# EAGLE design Asteroid-v4 (EAGLE 6.4)
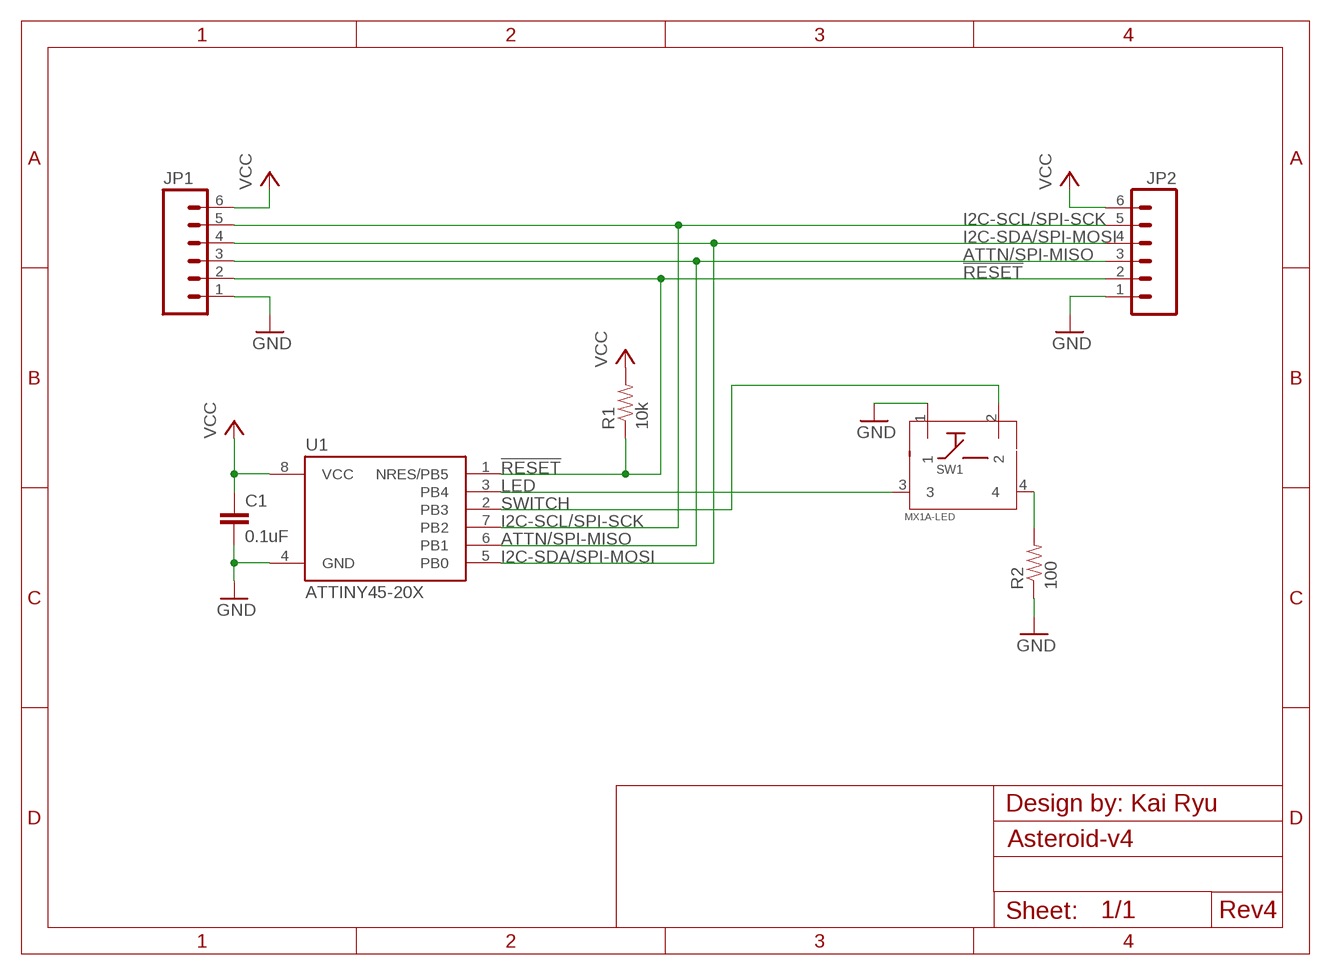
[diagram p0: schematic, sheet 1]

## Parts
C1  0.1uF  CAP0603-CAP  [0603-CAP]
JP1  M06SIP  [1X06]
JP2  M06SIP  [1X06]
R1  10k  RESISTOR0603-RES  [0603-RES]
R2  100  RESISTOR0603-RES  [0603-RES]
SW1  MX1A-LED  [MX1A-LED]
U1  ATTINY45-20X  [TSSOP8_4MM4]

## Nets
!RESET!: JP1.2 JP2.2 R1.1 U1.1(NRES/PB5)
ATTN/SPI-MISO: JP1.3 JP2.3 U1.6(PB1)
GND [GND]: C1.2 JP1.1 JP2.1 R2.1 SW1.1 U1.4(GND)
I2C-SCL/SPI-SCK: JP1.5 JP2.5 U1.7(PB2)
I2C-SDA/SPI-MOSI: JP1.4 JP2.4 U1.5(PB0)
LED: SW1.3 U1.3(PB4)
N$1: R2.2 SW1.4
SWITCH: SW1.2 U1.2(PB3)
VCC [VCC]: C1.1 JP1.6 JP2.6 R1.2 U1.8(VCC)

## Notes on the sheet
- Design by: Kai Ryu
- Rev4

## Library data of the parts
C1 = SparkFun-Passives:CAP: Capacitor Standard 0603 ceramic capacitor, and 0.1" leaded capacitor.
JP1 JP2 = SparkFun-Connectors:M06: Header 6 Standard 6-pin 0.1" header. Use with straight break away headers (SKU : PRT-00116), right angle break away headers (PRT-00553), swiss pins (PRT-00743), machine pins (PRT-00117), and female headers (PRT-00115). Molex polarized connector foot print use with SKU : PRT-08094 with associated crimp pins and housings. NOTES ON THE VARIANTS LOCK and LOCK_LONGPADS... This footprint was designed to help hold the alignment of a through-hole component (i.e. 6-pin header) while soldering it into place. You may notice that each hole has been shifted either up or down by 0.005 of an inch from it's more standard position (which is a perfectly straight line). This slight alteration caused the pins (the squares in the middle) to touch the edges of the holes. Because they are alternating, it causes a "brace" to hold the component in place. 0.005 has proven to be the perfect amount of "off-center" position when using our standard breakaway headers. Although looks a little odd when you look at the bare footprint, once you have a header in there, the alteration is very hard to notice. Also, if you push a header all the way into place, it is covered up entirely on the bottom side. This idea of altering the position of holes to aid alignment will be further integrated into the Sparkfun Library for other footprints. It can help hold any component with 3 or more connection pins.
R1 R2 = SparkFun-Resistors:RESISTOR: Resistor Basic schematic elements and footprints for 0603, 1206, and PTH resistors.
SW1 = cherry-mx-1:MX1A-LED
U1 = attiny25_45_85:ATTINY45*: ATMEL ATtiny 45 Packages: P = PDIP 08 30mil S = SOIC 08 EIAJ 208mil X = TSSOP 08 4.4mm Technologies Note: for complete ordering code (temp. range, finish, tape&reel etc.) see www.atmel.com • Supply Voltage: V = (1.8…5.5)V | [blank] = (2.7…5.5)V • Speed: 10 = 10 MHz | 20 = 20 MHz Author: Dipl.-Ing. FH Rainer Bayer HHN Hochschule Heilbronn (Heilbronn University), rainer.bayer@hs-heilbronn.de Ingenieurbüro ing-rb, mail@ing-rb.de

## Net classes
2 VCC: width 0.305 mm

## Board
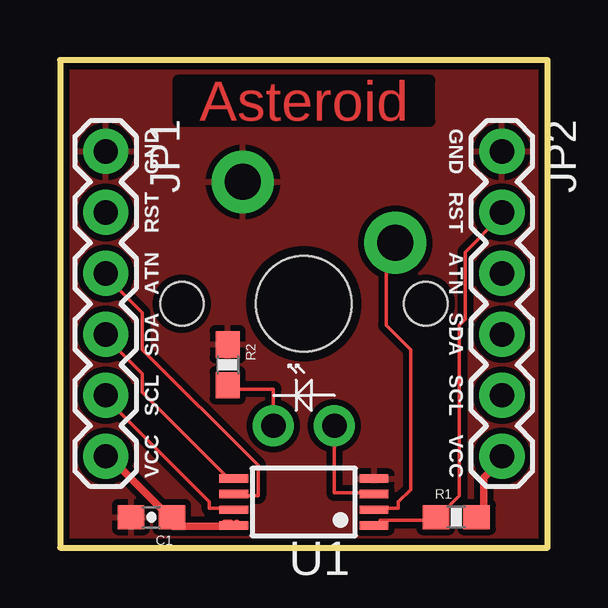
[diagram p1: board, top side]
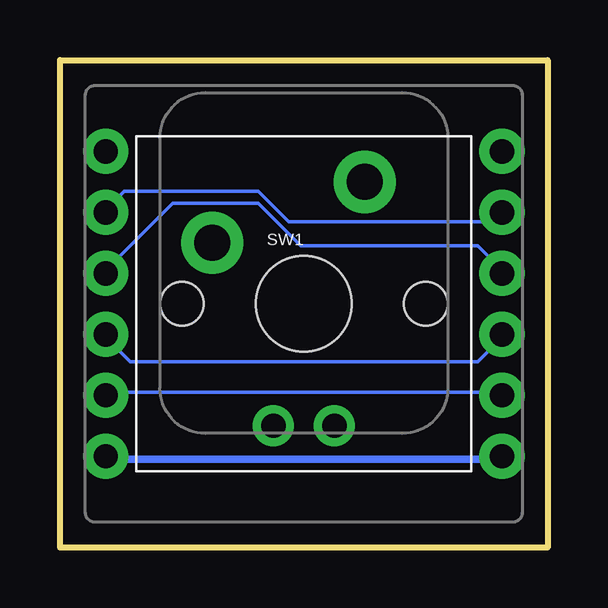
[diagram p2: board, bottom side, seen from below]

Size 20.32 x 20.32 mm. Coordinates in mm from the lower left corner, seen from the top.
Outline: 0,0 20.32,0 20.32,20.32 0,20.32 0,0
Copper layers (1*16): Top 0.035mm / dielectric 1.5mm / Bottom 0.035mm
Design rules "Fusion_eagle_rule_v1.1": minimum track width 6mil, minimum drill 12mil, track to track 6mil, track to pad 6mil, pad to pad 6mil, via to via 6mil, smd to smd 0mil, copper to edge 10mil, drill to drill 10mil, minimum pad ring 10mil, minimum via ring 6mil, stop-mask expansion 2mil, vias tented up to drill 100mil, thermal gap 10mil

### Footprints (pad centres in the part's own frame; a part is rotated, then mirrored left to right if it is on the bottom)
0603-CAP = smd 1.1 x 1: 1 -0.85,0; 2 0.85,0
1X06 = drill 1.016 pad 1.88: 1 0,0; 2 2.54,0; 3 5.08,0; 4 7.62,0; 5 10.16,0; 6 12.7,0
0603-RES = smd 1.1 x 1: 1 -0.85,0; 2 0.85,0
MX1A-LED = drill 1.499 pad 2.591: 1 2.54,5.08; 2 -3.81,2.54 | drill 1.016 pad 1.702: 3 -1.27,-5.08; 4 1.27,-5.08 | hole 3.988: 0,0 | hole 1.803: 5.08,0; -5.08,0
TSSOP8_4MM4 = smd 1.2 x 0.35: 1 -2.925,0.975; 2 -2.925,0.325; 3 -2.925,-0.325; 4 -2.925,-0.975; 5 2.925,-0.975; 6 2.925,-0.325; 7 2.925,0.325; 8 2.925,0.975

### Placement (x,y rotation side)
C1  3.81,1.27 180 top
JP1  1.91,16.51 270 top
JP2  18.41,16.51 270 top
R1  16.51,1.27 0 top
R2  6.99,7.62 270 top
SW1  10.16,10.16 0 bottom
U1  10.16,1.91 180 top

### Tracks (layer width: path | path; a pad name or v marks a point on that pad's centre or on a via)
!RESET!
  Top 0.152: U1.1 13.34,0.89 13.34,1.14 15.62,1.14 R1.1 15.88,1.4 16.64,2.16 16.64,9.27 16.89,9.53 16.89,12.32 18.41,13.84 JP2.2
  Bottom 0.152: JP1.2 1.91,13.84 2.16,13.59 10.79,13.59 12.06,14.86 17.65,14.86 18.41,14.1 JP2.2
ATTN/SPI-MISO
  Top 0.152: U1.6 7.24,2.16 8.26,2.16 8.26,3.43 3.43,8.26 3.43,9.78 1.91,11.3 JP1.3
  Bottom 0.152: JP2.3 18.41,11.56 15.62,14.35 12.06,14.35 10.29,12.57 2.92,12.57 1.91,11.56 JP1.3
GND
  pour Top (isolate 0.254): 0,20.32 20.32,20.32 20.32,0 0,0
I2C-SCL/SPI-SCK
  Top 0.152: U1.7 6.99,1.65 6.22,1.65 6.22,1.91 1.91,6.22 JP1.5
  Bottom 0.152: JP2.5 18.41,6.48 1.91,6.48 JP1.5
I2C-SDA/SPI-MOSI
  Top 0.152: U1.5 6.99,2.92 3.43,6.48 3.43,7.24 1.91,8.76 JP1.4
  Bottom 0.152: JP2.4 18.41,8.76 17.4,7.75 2.92,7.75 1.91,8.76 JP1.4
LED
  Top 0.152: SW1.3 11.43,2.29 12.95,2.29 U1.3
N$1
  Top 0.152: SW1.4 8.89,6.6 7.11,6.6 R2.2
SWITCH
  Top 0.152: SW1.2 13.59,12.32 13.59,9.27 14.61,8.26 14.61,2.41 14.1,1.91 14.1,1.65 13.34,1.65 U1.2
VCC
  Top 0.305: R1.2 17.4,1.4 17.65,1.65 17.65,2.92 18.41,3.68 JP2.6 | JP1.6 1.91,3.94 4.45,1.4 C1.1 4.7,1.14 4.7,0.89 6.86,0.89 | 6.86,0.89 6.99,0.89 | 7.37,1.02 U1.8 7.11,1.02 6.86,1.02 6.86,0.89
  Bottom 0.305: JP2.6 18.41,3.68 1.91,3.68 JP1.6

### Text on the board
Top: Asteroid
tPlace: GND | GND | RST | RST | ATN | ATN | SDA | SDA | SCL | SCL | VCC | VCC